# Altium schematic sheet PAGE3-BLE, LORA, RTC.SchDoc
size A3
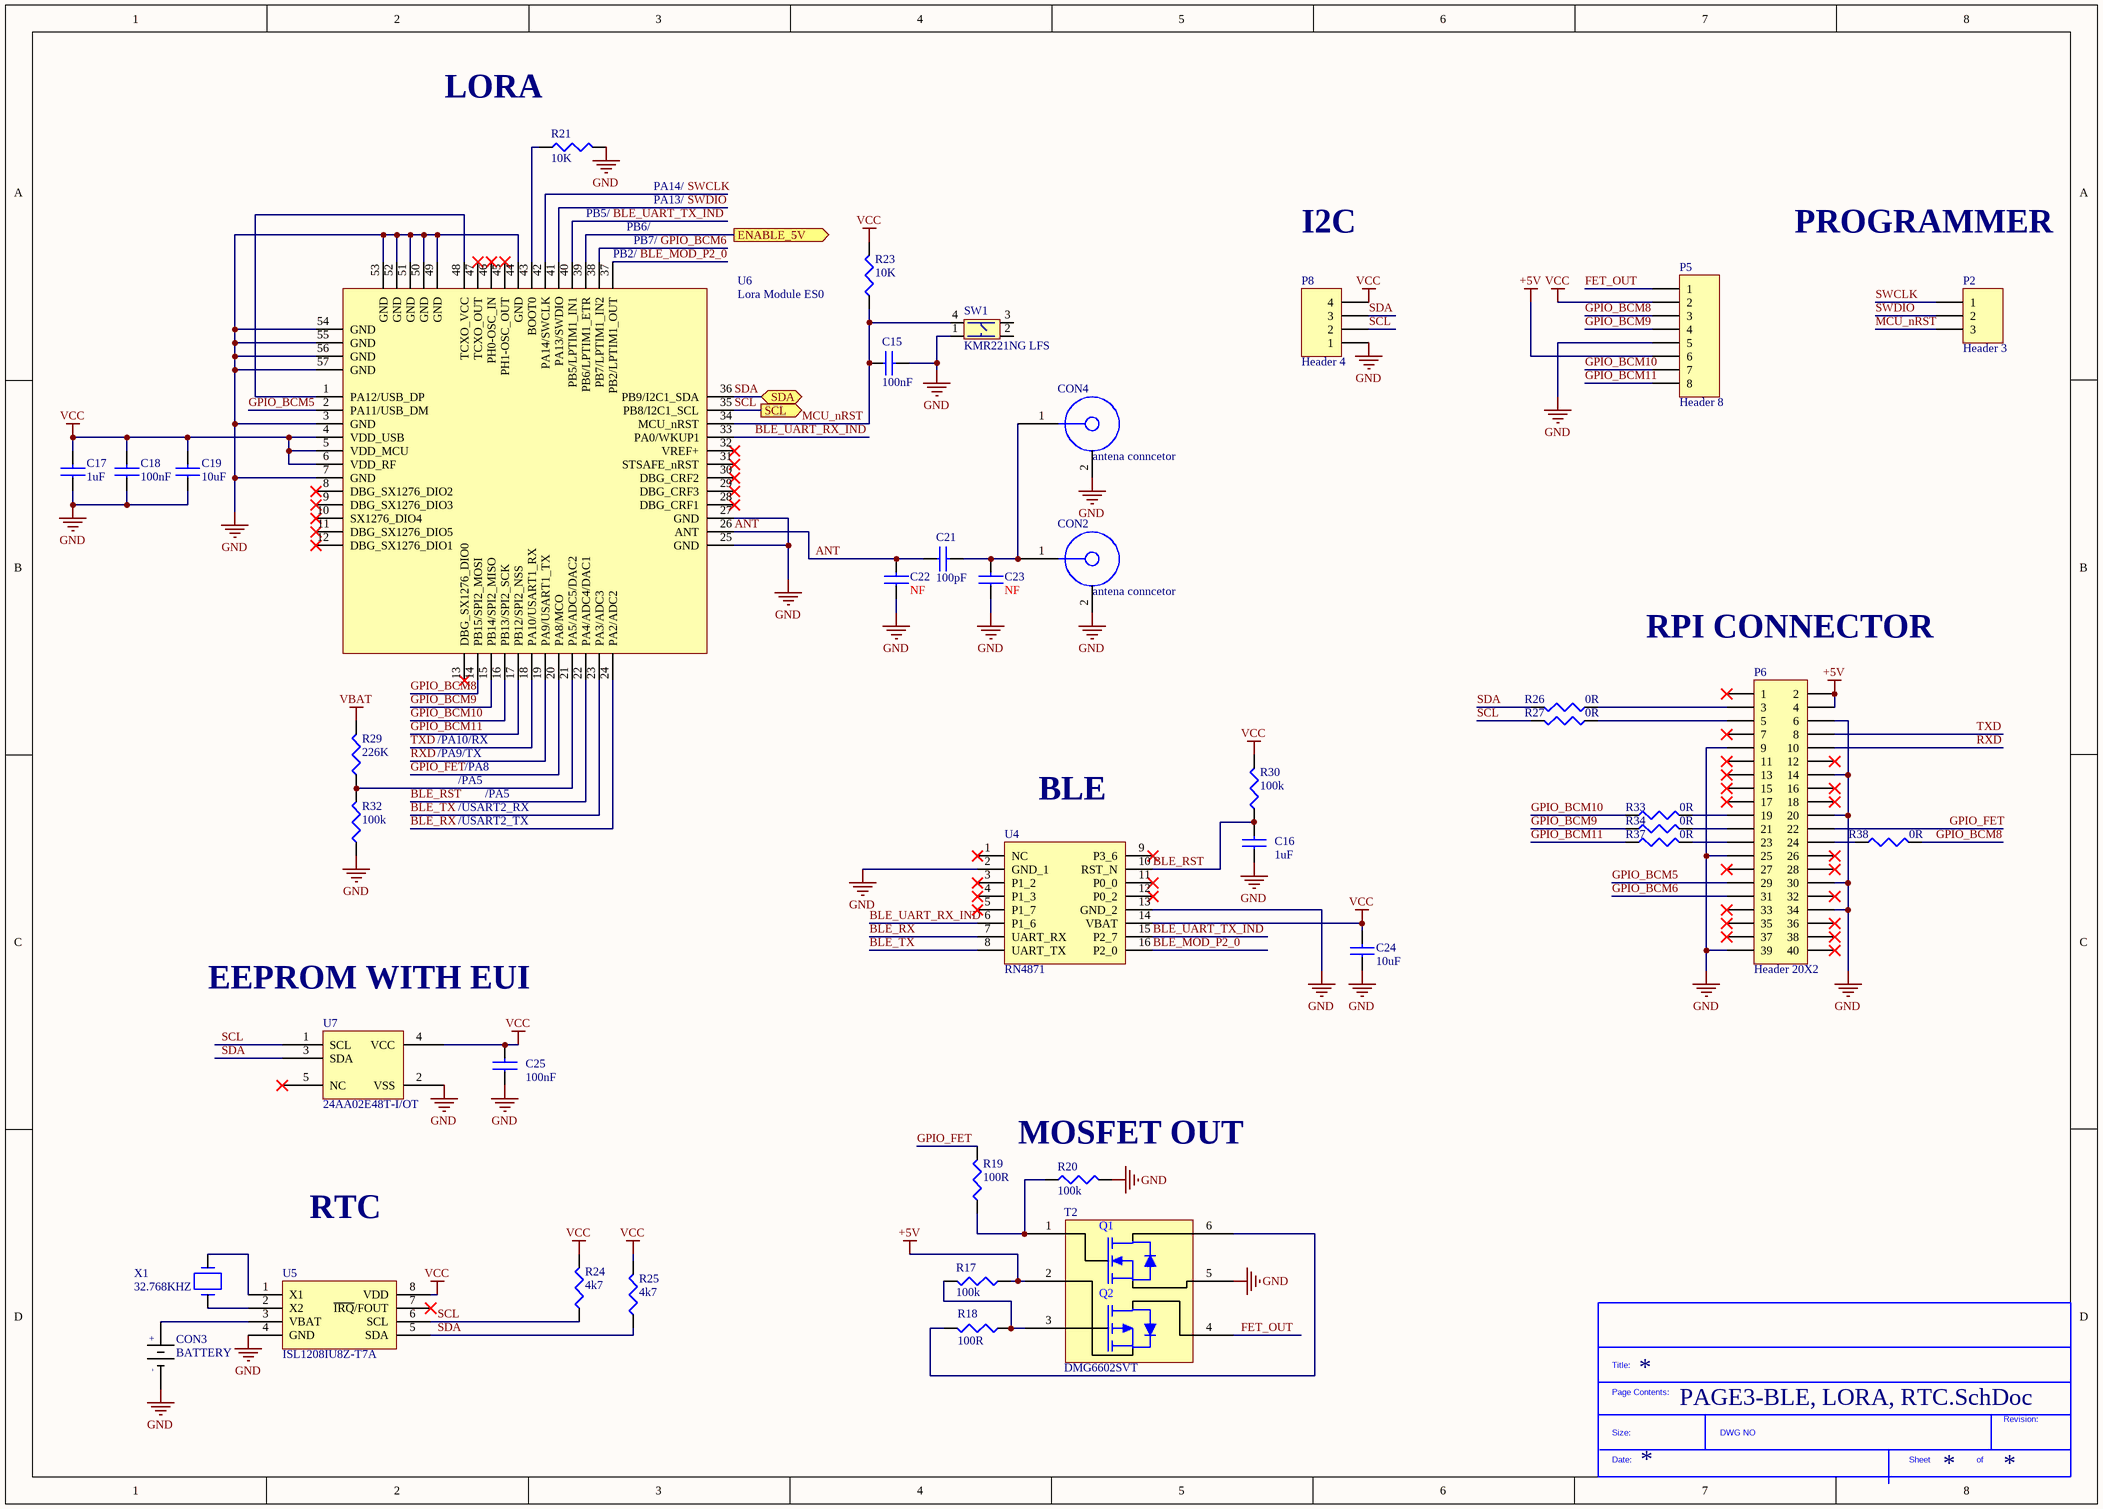
[diagram p0: PAGE3-BLE, LORA, RTC.SchDoc]

## Parts
*?  SDTitleBlock  (value not drawn)  (graphical)
C15  100nF  [CAP0603]
C16  1uF  [CAP0603]
C17  1uF  [CAP0603]
C18  100nF  [CAP0603]
C19  10uF  [CAP0603]
C21  100pF  [CAP0402]
C22  NF  [CAP0402]
C23  NF  [CAP0402]
C24  10uF  [CAP0603]
C25  100nF  [CAP0603]
CON2  antena conncetor  [ufl connector smd]
CON3  BATTERY  [CR-2032/VCN]
CON4  antena conncetor  [ufl connector smd]
P2  Header 3  [HDR1X3]
P5  Header 8  [HDR1X8]  (no BOM)
P6  Header 20X2  [HDR2X20]  (no BOM)
P8  Header 4  [HDR1X4]
R17  100k  [RES0603]
R18  100R  [RES0603]
R19  100R  [RES0603]
R20  100k  [RES0603]
R21  10K  [RES0603]
R23  10K  [RES0603]
R24  4k7  [RES0603]
R25  4k7  [RES0603]
R26  0R  [RES0603]
R27  0R  [RES0603]
R29  226K  [RES0603]
R30  100k  [RES0603]
R32  100k  [RES0603]
R33  0R  [RES0603]
R34  0R  [RES0603]
R37  0R  [RES0603]
R38  0R  [RES0603]
SW1  KMR221NG LFS  [Tactile button]
T2  DMG6602SVT  [TSOT26]
U4  RN4871  [RN4871]
U5  ISL1208IU8Z-T7A  [TSOP65P500X110-8N]
U6  Lora Module ES0  [Lora Module ES0]
U7  24AA02E48T-I/OT  [SOT95P280X145-5N]
X1  32.768KHZ  [LFXTAL009678]

## Ports
ENABLE_5V (out), SCL (out), SDA (bidir)

## Nets
+5V: P5.6 P6.2 P6.4 R17.1 T2.2(S2)
GND: C15.2 C16.1 C17.1 C18.1 C19.1 C22.1 C23.1 C24.1 C25.1 CON2.2 CON3.NEG CON4.2 P5.5 P6.6 P6.9 P6.14 P6.20 P6.25 P6.30 P6.34 P6.39 P8.1 R20.2 R21.2 R32.1 SW1.1 T2.5(S1) U4.2(GND_1) U4.13(GND_2) U5.4(GND) U6.3(GND) U6.7(GND) U6.25(GND) U6.27(GND) U6.44(GND) U6.49(GND) U6.50(GND) U6.51(GND) U6.52(GND) U6.53(GND) U6.54(GND) U6.55(GND) U6.56(GND) U6.57(GND) U7.2(VSS)
VBAT: R29.2
VCC: C17.2 C18.2 C19.2 C24.2 C25.2 P5.2 P8.4 R23.2 R24.2 R25.2 R30.2 U4.14(VBAT) U5.8(VDD) U6.4(VDD_USB) U6.5(VDD_MCU) U6.6(VDD_RF) U7.4(VCC)
ANT: C21.1 C22.2 U6.26(ANT)
BLE_MOD_P2_0: U4.16(P2_0) U6.37(PB2/LPTIM1_OUT)
BLE_RST: C16.2 R30.1 U4.10(RST_N) U6.22(PA4/ADC4/DAC1)
BLE_RX: U4.7(UART_RX) U6.24(PA2/ADC2)
BLE_TX: U4.8(UART_TX) U6.23(PA3/ADC3)
BLE_UART_RX_IND: U4.6(P1_6) U6.33(PA0/WKUP1)
BLE_UART_TX_IND: U4.15(P2_7) U6.40(PB5/LPTIM1_IN1)
ENABLE_5V: U6.39(PB6/LPTIM1_ETR) ; port ENABLE_5V
FET_OUT: P5.1 T2.4(D2)
GPIO_BCM5: P6.29 U6.2(PA11/USB_DM)
GPIO_BCM6: P6.31 U6.38(PB7/LPTIM1_IN2)
GPIO_BCM8: P5.3 R38.2 U6.14(PB15/SPI2_MOSI)
GPIO_BCM9: P5.4 R34.1 U6.15(PB14/SPI2_MISO)
GPIO_BCM10: P5.7 R33.1 U6.16(PB13/SPI2_SCK)
GPIO_BCM11: P5.8 R37.1 U6.17(PB12/SPI2_NSS)
GPIO_FET: P6.22 R19.2 U6.20(PA8/MCO)
MCU_nRST: C15.1 P2.3 R23.1 SW1.4 U6.34(MCU_nRST)
RXD: P6.10 U6.19(PA9/USART1_TX)
SCL: P8.2 R24.1 R27.2 U5.6(SCL) U6.35(PB8/I2C1_SCL) U7.1(SCL) ; port SCL
SDA: P8.3 R25.1 R26.2 U5.5(SDA) U6.36(PB9/I2C1_SDA) U7.3(SDA) ; port SDA
SWCLK: P2.1 U6.42(PA14/SWCLK)
SWDIO: P2.2 U6.41(PA13/SWDIO)
TXD: P6.8 U6.18(PA10/USART1_RX)
NetC21_2: C21.2 C23.2 CON2.1 CON4.1
NetCON3_POS: CON3.POS U5.3(VBAT)
NetP6_3: P6.3 R26.1
NetP6_5: P6.5 R27.1
NetP6_19: P6.19 R33.2
NetP6_21: P6.21 R34.2
NetP6_23: P6.23 R37.2
NetP6_24: P6.24 R38.1
NetR17_2: R17.2 R18.1 T2.3(G2)
NetR18_2: R18.2 T2.6(D1)
NetR19_1: R19.1 R20.1 T2.1(G1)
NetR21_1: R21.1 U6.43(BOOT0)
NetR29_1: R29.1 R32.2 U6.21(PA5/ADC5/DAC2)
NetU5_1: U5.1(X1) X1.2
NetU5_2: U5.2(X2) X1.1
NetU6_1: U6.1(PA12/USB_DP) U6.48(TCXO_VCC)

Not connected (* = marked no-connect by the designer): P6 1* 7* 11* 12* 13* 15* 16* 17* 18* 26* 27* 28* 32* 33* 35* 36* 37* 38* 40*; SW1 2 3; U4 1(NC)* 3(P1_2)* 4(P1_3)* 5(P1_7)* 9(P3_6)* 11(P0_0)* 12(P0_2)*; U5 7(~{IRQ}/FOUT)*; U6 8(DBG_SX1276_DIO2)* 9(DBG_SX1276_DIO3)* 10(SX1276_DIO4)* 11(DBG_SX1276_DIO5)* 12(DBG_SX1276_DIO1)* 13(DBG_SX1276_DIO0)* 28(DBG_CRF1)* 29(DBG_CRF3)* 30(DBG_CRF2)* 31(STSAFE_nRST)* 32(VREF+)* 45(PH1-OSC_OUT)* 46(PH0-OSC_IN)* 47(TCXO_OUT)*; U7 5(NC)*

## Notes on the sheet
- LORA
- PB5/
- PB6/
- (near U6) PB7/
- PA13/
- PA14/
- I2C
- PROGRAMMER
- (near U6) PB2/
- (near P6) RPI CONNECTOR
- /PA9/TX
- /PA10/RX
- /PA5
- /PA8
- /USART2_RX
- /USART2_TX
- (near U4) BLE
- EEPROM WITH EUI
- MOSFET OUT
- RTC
- (in symbol CR-2032/VCN) +; -
- (in symbol DMG6602SVT) Q1; Q2
- (in symbol SDTitleBlock) Title:; Page Contents:; Revision:; Size:; DWG NO; Date:; Sheet; of

## Library data of the parts
C15 C18 C25 = 100nF: MURATA - GRM188R71C104KA01J - CAP, MLCC, X7R, 0.1UF, 16V, 0603; Ceramic Capacitor Case: 0603 [1608 Metric]; Capacitance: 0.1; Voltage Rating: 16; Capacitance Tolerance: ± 10%; Dielectric Characteristic: X7; Product Range: GRM Series; SVHC: No SVHC (20-Jun-2016; Supplier 1: Farnell; Manufacturer: MURATA; Manufacturer Part Number: GRM188R71C104KA01J; RoHS: YES; Stock 1: 18297; Pricing 1: 10=0.0145, 100=0.0126, 500=0.0081, 2500=0.0059, 5000=0.0052, 10000=0.0046, 50000=0.0036, 100000=0.0035 (GBP); Packaging: Cut Tape; Operating Temperature Min: -55; Operating Temperature Max: 125; Automotive Qualification Standard: -; MSL: MSL 1 - Unlimited; ComponentLink1URL: http://www.farnell.com/datasheets/2189124.pdf; ComponentLink1Description: http://www.farnell.com/datasheets/2189124.pdf; Supplier Part Number 1: 2688519
C16 C17 = 1uF: MURATA - GRM188R61H105KAALD - CAP, MLCC, X5R, 1UF, 50V, 0603; Ceramic Capacitor Case: 0603 [1608 Metric]; Capacitance: 1; Voltage Rating: 50; Capacitance Tolerance: ± 10%; Dielectric Characteristic: X5; Product Range: GRM Series; SVHC: No SVHC (17-Dec-2015); Capacitor Terminals: SMD<!--FANDB--><div class="features-and-benefits-container"><div class="features-and-benefits-description"><span class="features-benefits-value">The Murata GRM series capacitors are Multilayer Ceramic Chip Capacitors (MLCC) used for general purpose applications. These MLCC capacitors are classified into temperature compensating and high dielectric constant types depending on the change in electrostatic capacitance due to change in temperature. The temperature compensating capacitors feature a small rate of change in electrostatic capacitance as the temperature changes and are used for applications such as filters and high frequency circuit matching. The high dielectric constant capacitors use materials with a high dielectric constant and feature a large electrostatic capacitance. Typical applications are power supply decoupling and smoothing circuits.</span></div><div class="features-and-benefits-list"><ul class="features-and-benefits-list-list"><li class="features-and-benefits-list-item">Large capacity and small size in a multilayer structure</li><li class="features-and-benefits-list-item">Capacitance value ranging from 0.1pF to 220?F</li><li class="features-and-benefits-list-item">Tin plated external electrodes, excellent solderability</li><li class="features-and-benefits-list-item">Provides good high frequency characteristics</li><li class="features-and-benefits-list-item">Excellent pulse response</li><li class="features-and-benefits-list-item">High reliability</li><li class="features-and-benefits-list-item">Capacitor size varies from 0.4×0.2mm to 5.7×5.0mm</li><li class="features-and-benefits-list-item">Rated voltage of 2.5VDC to 3.15; Supplier 1: Farnell; Manufacturer: MURATA; Manufacturer Part Number: GRM188R61H105KAALD; RoHS: YES; Stock 1: 62682; Pricing 1: 10=0.093, 100=0.062, 500=0.0507, 1000=0.0465, 2000=0.0429, 4000=0.0399, 20000=0.0372, 40000=0.0365 (GBP); Packaging: Cut Tape; Operating Temperature Min: -55; Operating Temperature Max: 85; Automotive Qualification Standard: -; MSL: -; Capacitance Tolerance ±: ± 10%; ComponentLink1URL: http://www.farnell.com/datasheets/2048611.pdf; ComponentLink1Description: http://www.farnell.com/datasheets/2048611.pdf; Supplier Part Number 1: 1845736
C19 C24 = 10uF: 10uf/0603/20%; Manufacturer: KEMET; Manufacturer Part Number: C0603C106M8PACTU; Supplier 1: Farnell; Stock 1: 0; Pricing 1: 10=0.555, 100=0.315, 500=0.238, 1000=0.2, 2000=0.174, 4000=0.143, 20000=0.123 (GBP); Supplier Part Number 1: 2820985
C21 = 100pF/0402: Cap Ceramic 100pF 50V X7R 10% SMD 0402 125C T/R; Manufacturer: KEMET; Manufacturer Part Number: C0402C101K5RACTU; Supplier 1: Farnell; Stock 1: 35279; Pricing 1: 10=0.0252, 100=0.0202, 500=0.0126, 2500=0.0084, 5000=0.0072 (EUR); Mount: Surface Mount; Case/Package: 0402; Case Code (Imperial): 0402; Case Code (Metric): 1005; Dielectric Material: Ceramic; Min Operating Temperature: -55°C; Max Operating Temperature: 125°C; Packaging: Tape and Reel; Package Quantity: 10000; Capacitance: 100pF; Voltage Rating: 50V; Voltage Rating (DC): 50V; Tolerance: 10%; Dielectric: X7R; Termination: SMD/SMT; Length: 1mm; Width: 0.5mm; Thickness: 0.02inch; Depth: 0.5mm; REACH SVHC: No SVHC; ComponentLink1URL: http://components.arrow.com/part/dataview/48781706S8928725N7429; ComponentLink1Description: http://components.arrow.com/part/dataview/48781706S8928725N7429; ComponentLink2URL: http://www.farnell.com/datasheets/2112152.pdf; ComponentLink2Description: http://www.farnell.com/datasheets/2112152.pdf; ComponentLink3URL: http://www.mouser.com/ds/2/212/KEM_C1002_X7R_SMD-1102033.pdf; ComponentLink3Description: http://www.mouser.com/ds/2/212/KEM_C1002_X7R_SMD-1102033.pdf; Supplier Part Number 1: 2522375
C22 C23 = CAP0402: Cap 0402 footprint only
CON2 CON4 = Antena copnnector: CONN UMC JACK STR 50 OHM SMD; Manufacturer: Hirose; Manufacturer Part Number: U.FL-R-SMT-1(10); Featured Product: U.FL Series Connectors; Connector Style: U.FL, Ultra Miniature Coaxial; Connector Type: Receptacle, Male Pin; Contact Termination: Solder; Impedance: 50 Ohm; Frequency - Max: 6GHz; Body Material: Phosphor Bronze; Body Finish: Silver; Center Contact Material: Brass; Center Contact Plating: Gold; Dielectric Material: Liquid Crystal Polymer (LCP); Online Catalog: UMCC (Ultra Miniature Coax Connectors), U.FL Series; Other Names: H11891TR  Q5400621  U.FL-R-SMT-1 10  U.FL-R-SMT-1(10)-ND  UFLRSMT110; Supplier 1: Farnell; Stock 1: 0; Standard Package: 2,500; Category: Connectors, Interconnects; Family: Coaxial Connectors (RF); Series: U.FL; Packaging: Tape & Reel (TR); Shield Termination: Solder; Mounting Type: Surface Mount; Cable Group: -; Fastening Type: Snap-On; Features: -; Housing Color: Beige; Ingress Protection: -; Voltage Rating: -; Operating Temperature: -40°C ~ 90°C; ComponentLink1URL: http://www.farnell.com/datasheets/91524.pdf; ComponentLink1Description: http://www.farnell.com/datasheets/91524.pdf; ComponentLink2URL: http://uk.rs-online.com/webdocs/1363/0900766b81363563.pdf; ComponentLink2Description: http://uk.rs-online.com/webdocs/1363/0900766b81363563.pdf; ComponentLink3URL: http://www.farnell.com/datasheets/1947917.pdf; ComponentLink3Description: http://www.farnell.com/datasheets/1947917.pdf; Supplier Part Number 1: 1688077
CON3 = CR-2032/VCN: BATT LITH COIN 3V CELL PC PINS; Manufacturer: Panasonic BSG; Brand: Panasonic Battery; Battery Size: 2032; Capacity: 225 mAh; Chemistry: Lithium; Rechargeable/Non-Rechargeable: Non-Rechargeable; Supplier 1: Farnell; Manufacturer Part Number: CR-2032/VCN; Stock 1: 1004; Pricing 1: 1=0.91, 50=0.892, 100=0.874, 500=0.855, 1000=0.837 (GBP); Product Category: Coin Cell Battery; RoHS: Not Applicable; Series: CR; Output Voltage: 3 V; Termination Style: Through Hole; Orientation: Vertical; Diameter: 20 mm; Height: 3.2 mm; Operating Temperature Range: - 30 C to + 60 C; Packaging: Bulk; Factory Pack Quantity: 480; Type: Lithium Primary Coil Batteries; Part # Aliases: CR-2032/VCN; ComponentLink1URL: http://www.mouser.com/ds/2/315/AAA4000CE51-586417.pdf; ComponentLink1Description: http://www.mouser.com/ds/2/315/AAA4000CE51-586417.pdf; ComponentLink2URL: http://uk.rs-online.com/webdocs/108e/0900766b8108ebf4.pdf; ComponentLink2Description: http://uk.rs-online.com/webdocs/108e/0900766b8108ebf4.pdf; ComponentLink3URL: https://na.industrial.panasonic.com/sites/default/pidsa/files/panasonic-lithium-cr2032-datasheet.pdf; ComponentLink3Description: https://na.industrial.panasonic.com/sites/default/pidsa/files/panasonic-lithium-cr2032-datasheet.pdf; Supplier Part Number 1: 1892670
P2 = Header 3: Header, 3-Pin; LatestRevisionDate: 17-Jul-2002; LatestRevisionNote: Re-released for DXP Platform.; Publisher: Altium Limited
P5 = Header 8: Header, 8-Pin; LatestRevisionDate: 17-Jul-2002; LatestRevisionNote: Re-released for DXP Platform.; Publisher: Altium Limited
P6 = Header 20X2: Header, 20-Pin, Dual row; LatestRevisionDate: 17-Jul-2002; LatestRevisionNote: Re-released for DXP Platform.; Publisher: Altium Limited
P8 = Header 4: Header, 4-Pin; LatestRevisionDate: 17-Jul-2002; LatestRevisionNote: Re-released for DXP Platform.; Publisher: Altium Limited
R17 R20 R30 R32 = 100k: MULTICOMP - MCMR06X104 JTL - RES, CERAMIC, 100K, 5%, 0.1W, 0603; Resistance: 100; Voltage Rating: 75; Resistor Case Style: 0603 [1608 Metric]; Product Range: MCMR Series; Temperature Coefficient: ± 100; Resistor Mounting: Surface Mount Device<!--FANDB--><div class="features-and-benefits-container"><div class="features-and-benefits-description"><span class="features-benefits-value">The Multicomp MCMR series resistors are automotive grade, anti sulphured thick film chip resistor. The resistance range includes E24 and E96 decade values from 1ohm to 10Mohm. These resistors are constructed on top of a high grade ceramic body.</span></div><div class="features-and-benefits-list"><ul class="features-and-benefits-list-list"><li class="features-and-benefits-list-item">EIA 0402, 0603, 0805, 1206 chip sizes available</li><li class="features-and-benefits-list-item">High reliability and stability</li><li class="features-and-benefits-list-item">Automotive grade AEC-Q200 compliant</li><li class="features-and-benefits-list-item">Complaint with (IEC 60068-1) 55/155/56 climatic category</li><li class="features-and-benefits-list-item">Maximum operation voltage of 50V, 75V, 150V and 200V</li><li class="features-and-benefits-list-item">Power rating of 62.5mW, 100mW, 125mW and 250mW</li><li class="features-and-benefits-list-item">Available in ±1% and ±5% tolerance</li><li class="features-and-benefits-list-item">Temperature coefficient (TCR) of +200ppm/°C, +100ppm/°C and -200ppm/°C to +400ppm/°C</li><li class="features-and-benefits-list-item">Operating temperature range -55°C to 155; Supplier 1: Farnell; Manufacturer: MULTICOMP; Manufacturer Part Number: MCMR06X104 JTL; RoHS: Y-EX; Stock 1: 187; Pricing 1: 10=0.0109, 100=0.0085, 500=0.006, 1000=0.0048, 2500=0.004, 5000=0.003, 25000=0.002, 50000=0.0016 (GBP); Power Rating: 100; Resistance Tolerance: ± 5%; Packaging: Cut Tape; Resistor Element Material: Ceramic; Automotive Qualification Standard: -; ComponentLink1URL: http://www.farnell.com/datasheets/1716707.pdf; ComponentLink1Description: http://www.farnell.com/datasheets/1716707.pdf; Supplier Part Number 1: 2073357
R18 R19 = 100R: MULTICOMP - MC0063W06031100R - RES, THICK FILM, 100R, 1%, 0.063W, 0603; Resistance: 100; Voltage Rating: 50; Resistor Case Style: 0603 [1608 Metric]; Power Rating: 63; Product Range: MC Series; Temperature Coefficient: ± 200; SVHC: No SVHC (12-Jan-2017); External Depth: 0.45; External Length / Height: 1.6; External Width: 0.8; No. of Pins: 2; Reel Quantity: 5000; Resistor Mounting: Surface Mount Device; Temperature Coeff. +: 200; Voltage Rating V DC: 50V<!--FANDB--><div class="features-and-benefits-container"><div class="features-and-benefits-description"><span class="features-benefits-value">The Multicomp MC series current sense resistors are thick film chip resistors. The resistance range includes E96 and E24 decade values from 1ohm to 10Mohm.</span></div><div class="features-and-benefits-list"><ul class="features-and-benefits-list-list"><li class="features-and-benefits-list-item">EIA 0402, 0603, 0805, 1206 chip sizes available</li><li class="features-and-benefits-list-item">Small size and low weight</li><li class="features-and-benefits-list-item">Suitable for both wave and reflow soldering</li><li class="features-and-benefits-list-item">Reduction of assembly costs</li><li class="features-and-benefits-list-item">Maximum working voltage of 50V(0402, 0603), 150V(0805), 200V(1206)</li><li class="features-and-benefits-list-item">Available in ±1%, ±2% and ±5% tolerance</li><li class="features-and-benefits-list-item">Power rating of 62.5mW, 100mW and 125mW</li><li class="features-and-benefits-list-item">±400ppm/°C(1ohm to 10ohm), ±200ppm/°C(11ohm to 100ohm), ±100; Manufacturer: MULTICOMP; Manufacturer Part Number: MC0063W06031100R; RoHS: Y-EX; Resistance Tolerance: ± 1%; Packaging: Cut Tape; Resistor Element Material: Thick Film; Automotive Qualification Standard: -; Operating Temperature Max: 155; Operating Temperature Min: -55; Operating Temperature Range: -55°C to +155; Tape Width: 8; Temperature Coeff. -: 200; Tolerance +: 1%; Tolerance -: 1%; ComponentLink1URL: http://www.farnell.com/datasheets/1788326.pdf; ComponentLink1Description: http://www.farnell.com/datasheets/1788326.pdf; ComponentLink2URL: http://www.farnell.com/cad/1561149.zip; ComponentLink2Description: http://www.farnell.com/cad/1561149.zip; ComponentLink3URL: http://www.farnell.com/datasheets/2289252.pdf; ComponentLink3Description: http://www.farnell.com/datasheets/2289252.pdf; Supplier 1: Farnell; Supplier Part Number 1: 2447227
R21 R23 = 10K: 10K resistor
R24 R25 = 4k7: MULTICOMP - MCMR06X4701FTL - RES, CERAMIC, 4K7, 1%, 0.1W, 0603; Resistance: 4.7; Voltage Rating: 75; Resistor Case Style: 0603 [1608 Metric]; Power Rating: 100; Product Range: MCMR Series; Temperature Coefficient: ± 100; SVHC: No SVHC (12-Jan-2017)<!--FANDB--><div class="features-and-benefits-container"><div class="features-and-benefits-description"><span class="features-benefits-value">The Multicomp MCMR series resistors are automotive grade, anti sulphured thick film chip resistor. The resistance range includes E24 and E96 decade values from 1ohm to 10Mohm. These resistors are constructed on top of a high grade ceramic body.</span></div><div class="features-and-benefits-list"><ul class="features-and-benefits-list-list"><li class="features-and-benefits-list-item">EIA 0402, 0603, 0805, 1206 chip sizes available</li><li class="features-and-benefits-list-item">High reliability and stability</li><li class="features-and-benefits-list-item">Automotive grade AEC-Q200 compliant</li><li class="features-and-benefits-list-item">Complaint with (IEC 60068-1) 55/155/56 climatic category</li><li class="features-and-benefits-list-item">Maximum operation voltage of 50V, 75V, 150V and 200V</li><li class="features-and-benefits-list-item">Power rating of 62.5mW, 100mW, 125mW and 250mW</li><li class="features-and-benefits-list-item">Available in ±1% and ±5% tolerance</li><li class="features-and-benefits-list-item">Temperature coefficient (TCR) of +200ppm/°C, +100ppm/°C and -200ppm/°C to +400ppm/°C</li><li class="features-and-benefits-list-item">Operating temperature range -55°C to 155; Supplier 1: Farnell; Manufacturer: MULTICOMP; Manufacturer Part Number: MCMR06X4701FTL; RoHS: Y-EX; Stock 1: 218618; Pricing 1: 10=0.0085, 100=0.0051, 500=0.0036, 1000=0.0028, 2500=0.0023 (GBP); Resistance Tolerance: ± 1%; Packaging: Cut Tape; Resistor Element Material: Ceramic; Automotive Qualification Standard: -; ComponentLink1URL: http://www.farnell.com/datasheets/1716707.pdf; ComponentLink1Description: http://www.farnell.com/datasheets/1716707.pdf; Supplier Part Number 1: 2073509
R26 R27 R33 R34 R37 R38 = 0R: BOURNS - CR0603-J/-000ELF - RES, THICK FILM, 0R, 5%, 0.1W, 0603; Resistance: 0; Voltage Rating: 50; Resistor Case Style: 0603 [1608 Metric]; Power Rating: 100; Product Range: CR Series; SVHC: No SVHC (17-Dec-2015); Resistor Mounting: Surface Mount Device<!--FANDB--><div class="features-and-benefits-container"><div class="features-and-benefits-description"><span class="features-benefits-value">The Bourns CR series are standard thick film chip resistors. These resistors provide flexibility of performance, space saving and low cost. The Resistance range includes E96 and E24 decade values from 1ohm to 10Mohm.</span></div><div class="features-and-benefits-list"><ul class="features-and-benefits-list-list"><li class="features-and-benefits-list-item">0201, 0402, 0603, 0805, 1206, 1210, 2010, 2512 standard case sizes available</li><li class="features-and-benefits-list-item">±1% and ±5% tolerance</li><li class="features-and-benefits-list-item">±100ppm/°C, ±200ppm/°C and ±250ppm/°C TCR values available</li><li class="features-and-benefits-list-item">Power rating selectable for 50mW, 63mW, 0.1W, 0.125W, 0.25W, 0.5W and 1W based on ordering</li><li class="features-and-benefits-list-item">Jumpers are available for all size</li><li class="features-and-benefits-list-item">3 layer termination process with nickel barrier prevents leaching & provides excellent solderability</li><li class="features-and-benefits-list-item">Suitable for all type of soldering processes</li><li class="features-and-benefits-list-item">Tight dimensional tolerances</li><li class="features-and-benefits-list-item">Maximum working voltage depends on case size</li><li class="features-and-benefits-list-item">Operating temperature of -55°C to +125°C(CR0201) and -55°C to +155; Supplier 1: Farnell; Manufacturer: BOURNS; Manufacturer Part Number: CR0603-J/-000ELF; RoHS: YES; Stock 1: 58200; Pricing 1: 10=0.0146, 250=0.0097, 1000=0.0073, 5000=0.0049, 12500=0.0042 (GBP); Resistance Tolerance: ± 5%; Packaging: Cut Tape; Resistor Element Material: Thick Film; Temperature Coefficient: -; Automotive Qualification Standard: -; MSL: MSL 1 - Unlimited; ComponentLink1URL: http://www.bourns.com/engineering/CHPREZTR/cr0603.stp; ComponentLink1Description: http://www.bourns.com/engineering/CHPREZTR/cr0603.stp; ComponentLink2URL: http://www.farnell.com/datasheets/2178762.pdf; ComponentLink2Description: http://www.farnell.com/datasheets/2178762.pdf; Supplier Part Number 1: 2008343
R29 = 226K: Thick Film Resistors - SMD 1/10watt 226Kohms 1%; Manufacturer: Vishay; Manufacturer Part Number: CRCW0603226KFKEA; Brand: Vishay / Dale; Power Rating: 100 mW; Temperature Coefficient: 100 PPM / K; Voltage Rating: 75 V; Unit Weight: 0.000071 oz; Supplier 1: Farnell; Stock 1: 6700; Pricing 1: 10=0.0188, 100=0.0145, 500=0.0124, 1000=0.008 (GBP); Product Category: Thick Film Resistors - SMD; RoHS: Details; Resistance: 226 kOhms; Tolerance: 1 %; Case Code - in: 0603; Case Code - mm: 1608; Operating Temperature Range: - 55 C to + 155 C; Series: CRCW; Height: 0.45 mm; Length: 1.55 mm; Package / Case: 0603 (1608 metric); Packaging: Reel; Product: Thick Film Resistors SMD; Factory Pack Quantity: 5000; Termination Style: SMD/SMT; Width: 0.85 mm; ComponentLink1URL: http://www.mouser.com/ds/2/427/dcrcwe3-109170.pdf; ComponentLink1Description: http://www.mouser.com/ds/2/427/dcrcwe3-109170.pdf; ComponentLink2URL: http://www.vishay.com/docs/20035/dcrcwe3.pdf; ComponentLink2Description: http://www.vishay.com/docs/20035/dcrcwe3.pdf; ComponentLink3URL: http://www.farnell.com/datasheets/2045674.pdf; ComponentLink3Description: http://www.farnell.com/datasheets/2045674.pdf; ComponentLink4URL: https://www.alliedelec.com/m/d/0c934d6939ccefa68dbe0b96d821c8cf.pdf; ComponentLink4Description: https://www.alliedelec.com/m/d/0c934d6939ccefa68dbe0b96d821c8cf.pdf; ComponentLink5URL: http://uk.rs-online.com/webdocs/0d98/0900766b80d98afc.pdf; ComponentLink5Description: http://uk.rs-online.com/webdocs/0d98/0900766b80d98afc.pdf; ComponentLink6URL: http://www.alliedelec.com/m/d/0c934d6939ccefa68dbe0b96d821c8cf.pdf; ComponentLink6Description: http://www.alliedelec.com/m/d/0c934d6939ccefa68dbe0b96d821c8cf.pdf; ComponentLink7URL: http://www.farnell.com/datasheets/2111203.pdf; ComponentLink7Description: http://www.farnell.com/datasheets/2111203.pdf; Supplier Part Number 1: 2138531
SW1 = Tactile button: SWITCH TACTILE SPST-NO 0.05A 32V; Manufacturer: ITT C&K; Pole Throw Configuration: SPST; Mechanical Life: 200000 Cycles; Switch Configuration: N.O.; Illumination Type: N/R; Ground Terminal: No; Body Orientation: Straight; Actuator Length: 0.5 mm; Operating Force: 2 N; Actuator Style: Round Button; Dielectric Strength: >=250 Vrms; Minimum Insulation Resistance: >=1000 MOhm; Contact Rating @ Voltage: 1 A; Supplier 1: C&K Components; Manufacturer Part Number: KMR221NGLFS; Stock 1: 4985; Pricing 1: 10=0.278, 500=0.264, 1000=0.208, 5000=0.204, 10000=0.2 (GBP); Part No: KMR221NGLFS; RoHS: Yes; Supplier Standard Pack: 7,000; Type: Micro-Miniature; Maximum AC Voltage Rating: N/A; Family: KMR 2; Contact Material: Silver; Actuator Color: N/A; Maximum DC Voltage Rating: 32 V; Seal Description: N/A; Packaging: Tape and Reel; Contact Plating: Silver; Electrical Life: N/A; Housing Material: N/A; Product Weight: N/A; Base Material: N/A; Mounting: Surface Mount,Gull Wing; Seal Location: N/A; Operating Temperature: -40 to 85 C; Dimension: 2.8 x 4.6 x 1.9 mm; HTS: 8536501199; ECCN: EAR99; ComponentLink1URL: https://www.ckswitches.com/media/1479/kmr2.pdf; ComponentLink1Description: https://www.ckswitches.com/media/1479/kmr2.pdf; ComponentLink2URL: http://www.ck-components.com/14414/kmr2_9aug12.pdf/; ComponentLink2Description: http://www.ck-components.com/14414/kmr2_9aug12.pdf/; ComponentLink3URL: http://www.ck-components.com/index.php?module=media&action=Display&cmpref=14414&lang=en&width=&height=&format=&alt=; ComponentLink3Description: http://www.ck-components.com/index.php?module=media&action=Display&cmpref=14414&lang=en&width=&height=&format=&alt=; ComponentLink4URL: http://www1.futureelectronics.com/doc/C%20-%20K%20COMPONENTS/KMR221NGLFS.pdf; ComponentLink4Description: http://www1.futureelectronics.com/doc/C%20-%20K%20COMPONENTS/KMR221NGLFS.pdf; Supplier Part Number 1: 2845727
T2 = DMG6602SVT: DIODES INC. - DMG6602SVT - MOSFET, NP CH, , 30V, 3.4, ATSOT23; Transistor Polarity: N and P Channel; Continuous Drain Current Id: 3.4; Drain Source Voltage Vds: 30; On Resistance Rds(on): 0.038; Rds(on) Test Voltage Vgs: 10; Threshold Voltage Vgs: 1; Power Dissipation Pd: 1.12; Transistor Case Style: TSOT-26; No. of Pins: 6; SVHC: No SVHC (17-Dec-2015); Continuous Drain Current Id, P Channel: -2.8; Drain Source Voltage Vds, P Channel: -30; Module Configuration: Dual; On Resistance Rds(on), P Channel: 0.073; Supplier 1: Farnell; Manufacturer: DIODES INC.; Manufacturer Part Number: DMG6602SVT; RoHS: YES; Stock 1: 4881; Pricing 1: 1=0.363, 25=0.339, 100=0.169, 250=0.166, 500=0.108, 1000=0.0809, 2000=0.0793, 6000=0.0777 (GBP); Operating Temperature Max: 150; Product Range: -; Automotive Qualification Standard: -; MSL: -; Continuous Drain Current Id, N Channel: 3.4; Drain Source Voltage Vds, N Channel: 30; On Resistance Rds(on), N Channel: 0.038; Operating Temperature Min: -55; Operating Temperature Range: -55°C to +150°C<!--FANDB--><div class="features-and-benefits-container"><div class="features-and-benefits-description"><span class="features-benefits-value">The DMG6602SVT from Diode Inc is a surface mount complementary pair enhancement mode MOSFET in TSOT-26 package. This MOSFET features low input capacitance, fast switching speed and low input/output leakage, designed to minimize the onstate resistance and maintain superior switching performance, making it ideal for high efficiency power management applications and backlighting.</span></div><div class="features-and-benefits-list"><ul class="features-and-benefits-list-list"><li class="features-and-benefits-list-item">Automotive grade AEC-Q101 qualified</li><li class="features-and-benefits-list-item">UL recognized</li><li class="features-and-benefits-list-item">Drain to source voltage (Vds) of 30V</li><li class="features-and-benefits-list-item">Gate to source voltage (Vgs) of ±20V</li><li class="features-and-benefits-list-item">Continuous drain current of 3.4A</li><li class="features-and-benefits-list-item">Power dissipation (Pd) of 1.27W</li><li class="features-and-benefits-list-item">Operating temperature range -55°C to 150°C</li><li class="features-and-benefits-list-item">Low on state resistance of 38mohm at Vgs of 10; ComponentLink1URL: http://www.farnell.com/datasheets/1915929.pdf; ComponentLink1Description: http://www.farnell.com/datasheets/1915929.pdf; Supplier Part Number 1: 2061522
U4 = RN4871-V/RM118: MICROCHIP         RN4871-V/RM118             BLE MOD W/ANTENNA, 2.442MHZ, 0.1DBI                          New; Supply Voltage Min: 1.9V; Supply Voltage Max: 3.6V; Bluetooth Version: Bluetooth 4.2; Bluetooth Class: Class 2; Receive Sensitivity: -90dBm; Product Range: RN Series; SVHC: No SVHC (17-Dec-2015); Supplier 1: Farnell; Manufacturer: Microchip; Manufacturer Part Number: RN4871-V/RM118; Stock 1: 2428; Pricing 1: 1=5.4, 25=5.08, 100=4.98 (GBP); Signal Range Max: -; Data Rate: -; Operating Temperature Min: -20°C; Operating Temperature Max: 70°C; Supplier Part Number 1: 2664514
U5 = ISL1208IU8Z-T7A: IC RTC/CALENDAR I2C LP 8MSOP; Manufacturer: Intersil; Max Supply Voltage: 5.5V; Min Supply Voltage: 2.7V; Non-volatile Memory Size: 2B; Interface: I2C,Serial,2-Wire; Logic Function: Clock; Time Format: HH:MM:SS; Date Format: YY-MM-DD-dd; Supplier 1: Farnell; Manufacturer Part Number: ISL1208IU8Z-T7A; Stock 1: 321; Pricing 1: 1=2.63, 10=2.24, 25=2.12, 50=2.01, 100=1.89, 250=1.84, 500=1.65, 1000=1.37 (EUR); Mount: Surface Mount; Case/Package: MSOP; Number of Pins: 8; Min Operating Temperature: -40°C; Max Operating Temperature: 85°C; Packaging: Tape and Reel; Package Quantity: 250; Memory Size: 2B; Radiation Hardening: No; REACH SVHC: Unknown; Lead Free: Lead Free; ComponentLink1URL: https://datasheet.ciiva.com/16293/fn8085-16293145.pdf; ComponentLink1Description: https://datasheet.ciiva.com/16293/fn8085-16293145.pdf; ComponentLink2URL: https://datasheet.ciiva.com/8145/fn8085-8145071.pdf; ComponentLink2Description: https://datasheet.ciiva.com/8145/fn8085-8145071.pdf; ComponentLink3URL: https://datasheet.ciiva.com/6668/fn8085-6668119.pdf; ComponentLink3Description: https://datasheet.ciiva.com/6668/fn8085-6668119.pdf; ComponentLink4URL: https://datasheet.ciiva.com/6668/fn8085-6668117.pdf; ComponentLink4Description: https://datasheet.ciiva.com/6668/fn8085-6668117.pdf; ComponentLink5URL: https://datasheet.ciiva.com/6668/fn8085-6668118.pdf; ComponentLink5Description: https://datasheet.ciiva.com/6668/fn8085-6668118.pdf; Supplier Part Number 1: 2543322
U6 = Lora Module Murata: Manufacturer Part Number: CMWX1ZZABZ-091; Supplier 1: Farnell; Manufacturer: Murata; Stock 1: 175; Pricing 1: 1=11.7, 5=11.06, 10=9.94, 50=9.54, 100=9.14, 250=8.05 (GBP); Supplier Part Number 1: 2802546
U7 = 24AA02E48T-I/OT: MICROCHIP   24AA02E48T-I/OT   EEPROM, EUI-48 Node Identity, 2 Kbit, 2 BLK (128K x 8bit), 400 kHz, I2C, SOT-23, 5 Pins; Interface: I2C,Serial; Access Time: 3500ns; Frequency: 400kHz; Max Supply Voltage: 5.5V; Min Supply Voltage: 1.7V; Nominal Supply Current: 3mA; Density: 2Kb; Operating Supply Voltage: 5V; Max Frequency: 100kHz; Supplier 1: Farnell; Manufacturer: Microchip; Manufacturer Part Number: 24AA02E48T-I/OT; Stock 1: 13638; Pricing 1: 1 = 0.17600, 10 = 0.17100, 25 = 0.16400, 50 = 0.16000, 100 = 0.15600 (GBP); RoHS: Yes; Mount: Surface Mount; Case/Package: SOT-23; Number of Pins: 5; Min Operating Temperature: -40°C; Max Operating Temperature: 85°C; Packaging: Tape and Reel; Package Quantity: 3000; Memory Type: EEPROM; Memory Size: 2Kb; Termination: SMD/SMT; Length: 3.1mm; Height: 1.3mm; Width: 1.8mm; Radiation Hardening: No; REACH SVHC: No SVHC; Lead Free: Lead Free; ComponentLink1URL: http://www.farnell.com/datasheets/1725195.pdf?src-supplier=Element14; ComponentLink1Description: http://www.farnell.com/datasheets/1725195.pdf?src-supplier=Element14; ComponentLink2URL: http://www.farnell.com/datasheets/631538.pdf?src-supplier=Element14; ComponentLink2Description: http://www.farnell.com/datasheets/631538.pdf?src-supplier=Element14; ComponentLink3URL: http://ww1.microchip.com/downloads/en/DeviceDoc/22124D.pdf?src-supplier=Avnet+Europe; ComponentLink3Description: http://ww1.microchip.com/downloads/en/DeviceDoc/22124D.pdf?src-supplier=Avnet+Europe; ComponentLink4URL: http://www.microchip.com/mymicrochip/filehandler.aspx?ddocname=en538826&src-supplier=Future+Electronics; ComponentLink4Description: http://www.microchip.com/mymicrochip/filehandler.aspx?ddocname=en538826&src-supplier=Future+Electronics; ComponentLink5URL: http://www.produktinfo.conrad.com/datenblaetter/650000-674999/651228-da-01-en-EEPROM_24AA02E48T_I_OT_SOT_23_5_MCP.pdf?src-supplier=Conrad; ComponentLink5Description: http://www.produktinfo.conrad.com/datenblaetter/650000-674999/651228-da-01-en-EEPROM_24AA02E48T_I_OT_SOT_23_5_MCP.pdf?src-supplier=Conrad; Supplier Part Number 1: 1688855
X1 = LFXTAL009678: CRYSTAL, 32.768KHZ, 12.5PF, SMD; Manufacturer: IQD; Frequency: 32.8kHz; Supplier 1: Farnell; Manufacturer Part Number: LFXTAL009678; Stock 1: 15609; Pricing 1: 5=0.283, 50=0.203, 250=0.169, 500=0.163, 1500=0.157, 3000=0.152, 15000=0.146 (EUR); Case/Package: 217; Number of Pins: 2; Min Operating Temperature: -40°C; Max Operating Temperature: 85°C; Load Capacitance: 12.5pF; REACH SVHC: No SVHC; ComponentLink1URL: https://datasheet.ciiva.com/46419/1852967-46419749.pdf; ComponentLink1Description: https://datasheet.ciiva.com/46419/1852967-46419749.pdf; Supplier Part Number 1: 2449398